# Altium schematic sheet SMPS.SchDoc
size A4; SheetNumber: 1; SheetTotal: 1
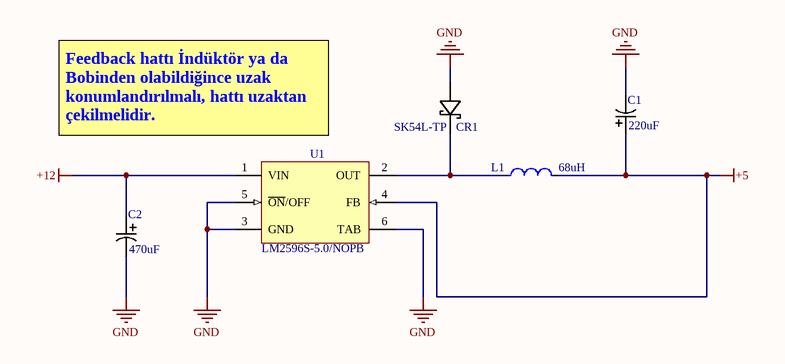
[diagram p0: SMPS.SchDoc]

## Parts
C1  220uF  [PCAP_8x10-ELECT_NCA]
C2  470uF  [CAPAE1710X1750N]
CR1  SK54L-TP  [SDO_SMC-DO-214AB_MCE]
L1  68uH  [FP-IHLP-6767GZ-FP_3_825x1-MFG]
U1  LM2596S-5.0/NOPB  [KTT0005B_L]

## Nets
+5: C1.1 L1.2 U1.4(FB)
+12: C2.1 U1.1(VIN)
GND: C1.2 C2.2 CR1.2 U1.3(GND) U1.5(~{ON}/OFF) U1.6(TAB)
NetCR1_1: CR1.1 L1.1 U1.2(OUT)

## Notes on the sheet
- (near U1) Feedback hattı İndüktör ya da Bobinden olabildiğince uzak konumlandırılmalı, hattı uzaktan çekilmelidir.

## Library data of the parts
C1 = UWZ1E221MCL1GS: No Description Available; Mfr_Name: Nichicon
C2 = UCZ1H471MNQ1MS: 470ÂµF 50V Aluminum Electrolytic Capacitors Radial, Can - SMD 80mOhm @ 100kHz 3500 Hrs @ 125Â°C; MF: Nichicon; SnapEDA_Link: https://www.snapeda.com/parts/UCZ1H471MNQ1MS/Nichicon/view-part/2424952/?ref=snap; Availability: Unavailable; Value: *; Price: None; MP: UCZ1H471MNQ1MS; Package: Radial Nichicon
CR1 = SK54L-TP: No Description Available; Mfr_Name: MCC
L1 = CMP-02424-000344-1: Commercial Inductors, Low DCR Series 68uH 6.1A 75.7mΩ 20%; Saturation Current: 4.5A; Core Material: Metal; Shielding: Shielded; DC Resistance (DCR): 75.7mR; Self Resonant Frequency: 3MHz; Test Frequency: 100kHz; Lead Free: Lead Free; Packaging: Tape and Reel; Current Rating: 6.1A; Tolerance: 20%; Military Standard: Not; Depth: 17.15mm; Radiation Hardening: No; Package Quantity: 200; Height - Seated (Max): 0.276inch; Max DC Current: 4.5A; Termination: SMD/SMT; Width: 17.15mm; Inductance: 68uH; Case/Package: 6767; RMS Current (Irms): 6.1A; Height: 7mm; Length: 17.15mm; Min Operating Temperature: -55°C; Mount: Surface Mount; Max Operating Temperature: 125°C; Number of Pins: 2; Inductance Tolerance: 20%
U1 = CMP-0069-00269-3: SIMPLE SWITCHER® Power Converter 150 KHz 3A Step-Down Voltage Regulator, 5-pin TO-263, Pb-Free; Manufacturer: Texas Instruments; PowerWise: N; PackageTopMarking: NSUZXYTTE#*LM2596S*-5.0 P+; ComponentLink1URL: http://www.ti.com/general/docs/lit/getliterature.tsp?genericPartNumber=LM2596&fileType=pdf; PackageDescription: TO-263, Molded, .400 x .390 x .180in, 5 Lead, .067in Pitch, Surface Mount; RoHS: Y; PinCount: 5; Code_JEDEC: MO-169-AB; ComponentLink1Description: Datasheet URL; PackageReference: KTT0005B; CompType: Switcher